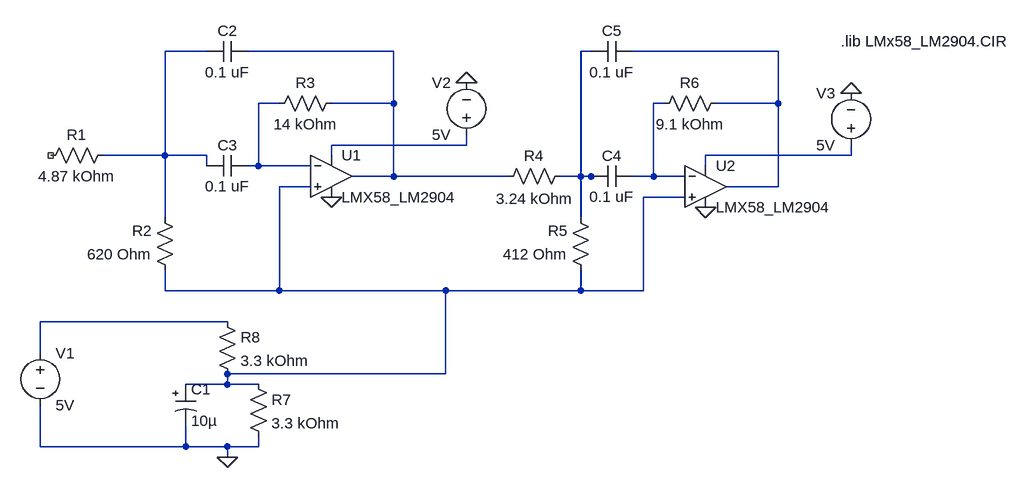
[diagram p0: schematic Draft1.asc]
Draft1.asc, the LTspice schematic file:
Version 4
SHEET 1 1232 680
WIRE 0 32 -64 32
WIRE 288 32 64 32
WIRE 592 32 576 32
WIRE 880 32 656 32
WIRE 112 112 80 112
WIRE 288 112 288 32
WIRE 288 112 192 112
WIRE 704 112 688 112
WIRE 880 112 880 32
WIRE 880 112 784 112
WIRE 400 176 400 160
WIRE 400 176 192 176
WIRE -64 192 -64 32
WIRE -64 192 -160 192
WIRE 0 192 -64 192
WIRE 192 192 192 176
WIRE 992 192 992 176
WIRE 992 192 768 192
WIRE 0 208 0 192
WIRE 80 208 80 112
WIRE 80 208 64 208
WIRE 160 208 80 208
WIRE 768 208 768 192
WIRE 288 224 288 112
WIRE 288 224 224 224
WIRE 464 224 288 224
WIRE 576 224 576 32
WIRE 576 224 544 224
WIRE 592 224 576 224
WIRE 608 224 592 224
WIRE 688 224 688 112
WIRE 688 224 656 224
WIRE 736 224 688 224
WIRE 160 240 112 240
WIRE 880 240 880 112
WIRE 880 240 800 240
WIRE 736 256 672 256
WIRE -64 288 -64 192
WIRE 576 288 576 224
WIRE -64 400 -64 368
WIRE 112 400 112 240
WIRE 112 400 -64 400
WIRE 368 400 112 400
WIRE 576 400 576 368
WIRE 576 400 368 400
WIRE 672 400 672 256
WIRE 672 400 576 400
WIRE 32 448 -256 448
WIRE -256 496 -256 448
WIRE 368 528 368 400
WIRE 368 528 32 528
WIRE 32 544 32 528
WIRE 32 544 -32 544
WIRE 80 544 32 544
WIRE -256 640 -256 576
WIRE -32 640 -32 608
WIRE -32 640 -256 640
WIRE 32 640 -32 640
WIRE 80 640 80 624
WIRE 80 640 32 640
WIRE 32 656 32 640
FLAG 32 656 0
FLAG 192 256 0
FLAG 768 272 0
FLAG 400 80 0
FLAG 992 96 0
SYMBOL res -144 176 R90
WINDOW 0 0 56 VBottom 2
WINDOW 3 32 56 VTop 2
SYMATTR InstName R1
SYMATTR Value 4.87 kOhm
SYMBOL res -48 384 R180
WINDOW 0 36 76 Left 2
WINDOW 3 36 40 Left 2
SYMATTR InstName R2
SYMATTR Value 620 Ohm
SYMBOL res 208 96 R90
WINDOW 0 0 56 VBottom 2
WINDOW 3 32 56 VTop 2
SYMATTR InstName R3
SYMATTR Value 14 kOhm
SYMBOL res 560 208 R90
WINDOW 0 0 56 VBottom 2
WINDOW 3 35 55 VTop 2
SYMATTR InstName R4
SYMATTR Value 3.24 kOhm
SYMBOL res 592 384 R180
WINDOW 0 36 76 Left 2
WINDOW 3 36 40 Left 2
SYMATTR InstName R5
SYMATTR Value 412 Ohm
SYMBOL res 800 96 R90
WINDOW 0 0 56 VBottom 2
WINDOW 3 32 56 VTop 2
SYMATTR InstName R6
SYMATTR Value 9.1 kOhm
SYMBOL polcap -48 544 R0
SYMATTR InstName C1
SYMATTR Value 10µ
SYMATTR Description Capacitor
SYMATTR Type cap
SYMATTR SpiceLine Rser=4 Lser=0 mfg="AVX" pn="TAJA106M006" type="Tantalum"
SYMBOL cap 64 16 R90
WINDOW 0 0 32 VBottom 2
WINDOW 3 32 32 VTop 2
SYMATTR InstName C2
SYMATTR Value 0.1 uF
SYMBOL cap 64 192 R90
WINDOW 0 0 32 VBottom 2
WINDOW 3 32 32 VTop 2
SYMATTR InstName C3
SYMATTR Value 0.1 uF
SYMBOL cap 656 208 R90
WINDOW 0 0 32 VBottom 2
WINDOW 3 32 32 VTop 2
SYMATTR InstName C4
SYMATTR Value 0.1 uF
SYMBOL res 64 528 R0
SYMATTR InstName R7
SYMATTR Value 3.3 kOhm
SYMBOL res 16 432 R0
SYMATTR InstName R8
SYMATTR Value 3.3 kOhm
SYMBOL cap 656 16 R90
WINDOW 0 0 32 VBottom 2
WINDOW 3 32 32 VTop 2
SYMATTR InstName C5
SYMATTR Value 0.1 uF
SYMBOL Opamps/opamp2 192 160 R0
SYMATTR InstName U1
SYMATTR Value LMX58_LM2904
SYMBOL Opamps/opamp2 768 176 R0
SYMATTR InstName U2
SYMATTR Value LMX58_LM2904
SYMBOL voltage -256 480 R0
SYMATTR InstName V1
SYMATTR Value 5V
SYMBOL voltage 400 176 R180
WINDOW 0 24 96 Left 2
WINDOW 3 24 16 Left 2
SYMATTR InstName V2
SYMATTR Value 5V
SYMBOL voltage 992 192 R180
WINDOW 0 24 96 Left 2
WINDOW 3 24 16 Left 2
SYMATTR InstName V3
SYMATTR Value 5V
TEXT 976 16 Left 2 !.lib LMx58_LM2904.CIR

The netlist it stands for:
* Draft1.asc
R1 N001 NC_01 4.87 kOhm
R2 N009 N001 620 Ohm
R3 N002 N005 14 kOhm
R4 N003 N002 3.24 kOhm
R5 N009 N003 412 Ohm
R6 N004 N006 9.1 kOhm
C1 N009 0 10µ Rser=4 Lser=0 mfg="AVX" pn="TAJA106M006" type="Tantalum"
C2 N002 N001 0.1 uF
C3 N005 N001 0.1 uF
C4 N006 N003 0.1 uF
R7 N009 0 3.3 kOhm
R8 N010 N009 3.3 kOhm
C5 N004 N003 0.1 uF
XU1 N009 N005 N007 0 N002 LMX58_LM2904  ; pins In+ In- V+ V- OUT
XU2 N009 N006 N008 0 N004 LMX58_LM2904  ; pins In+ In- V+ V- OUT
V1 N010 0 5V
V2 N007 0 5V
V3 N008 0 5V
.lib LMx58_LM2904.CIR
.backanno
.end